# EAGLE design playameter (EAGLE 5.10)
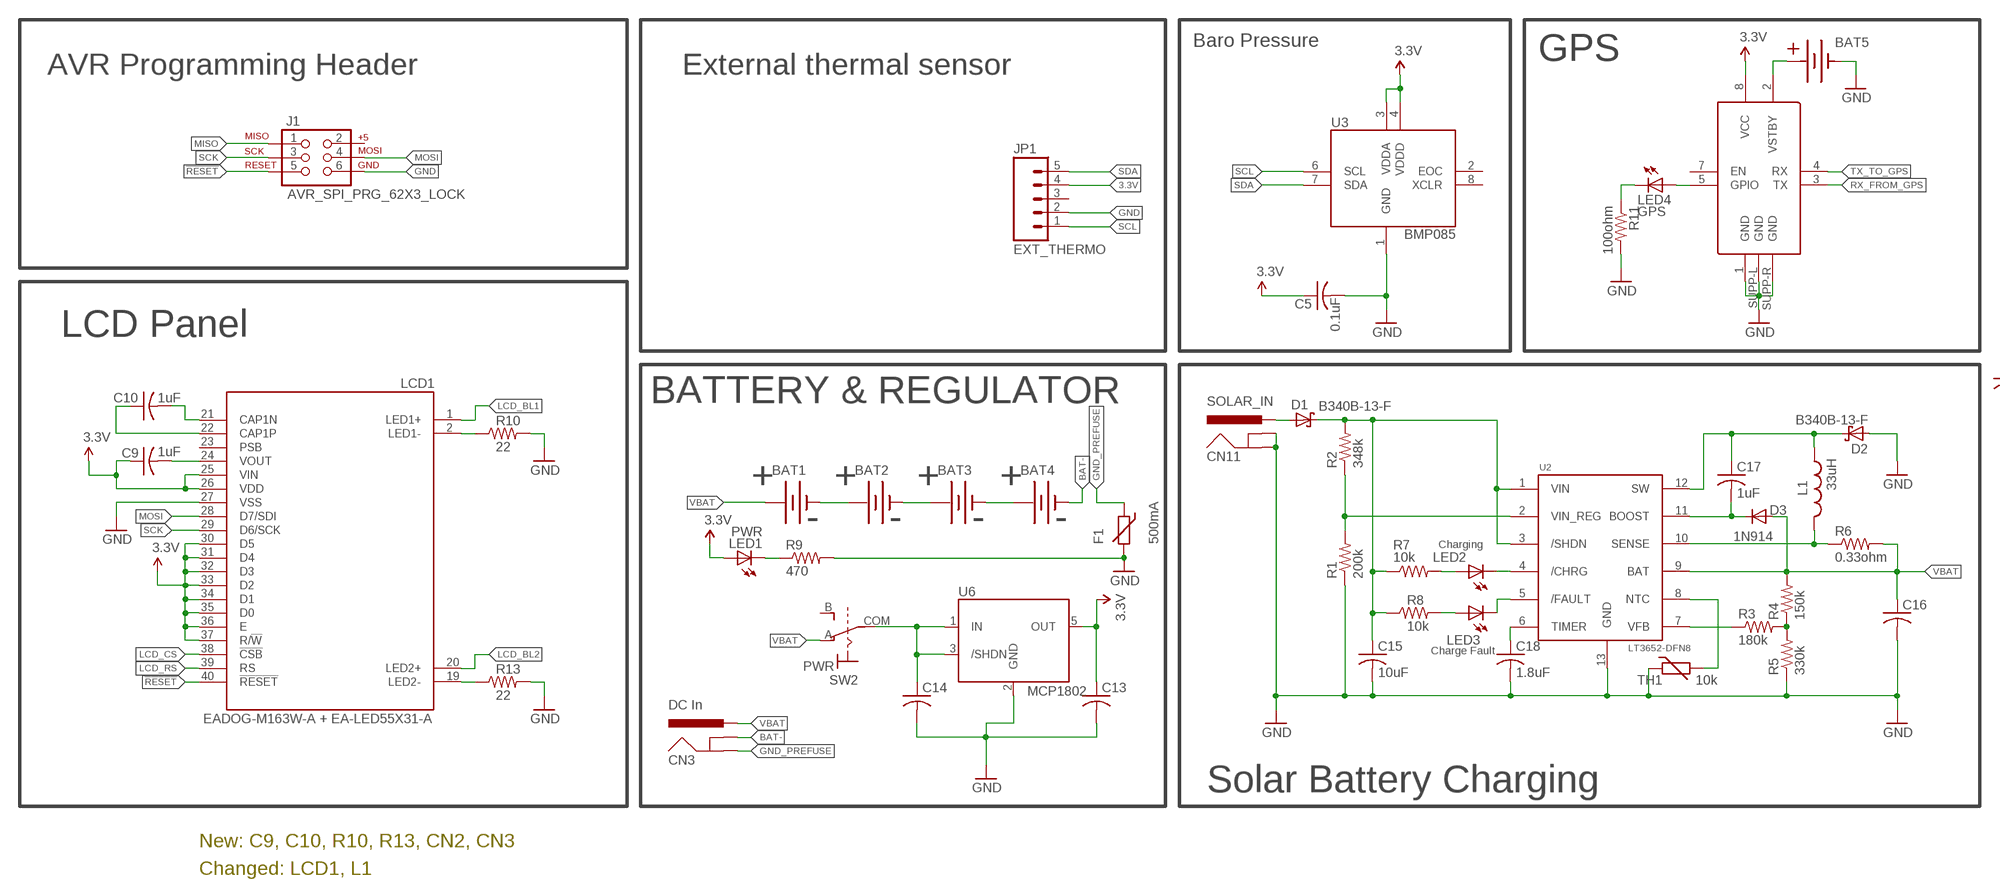
[diagram p0: schematic, sheet 1, part 1 of 2]
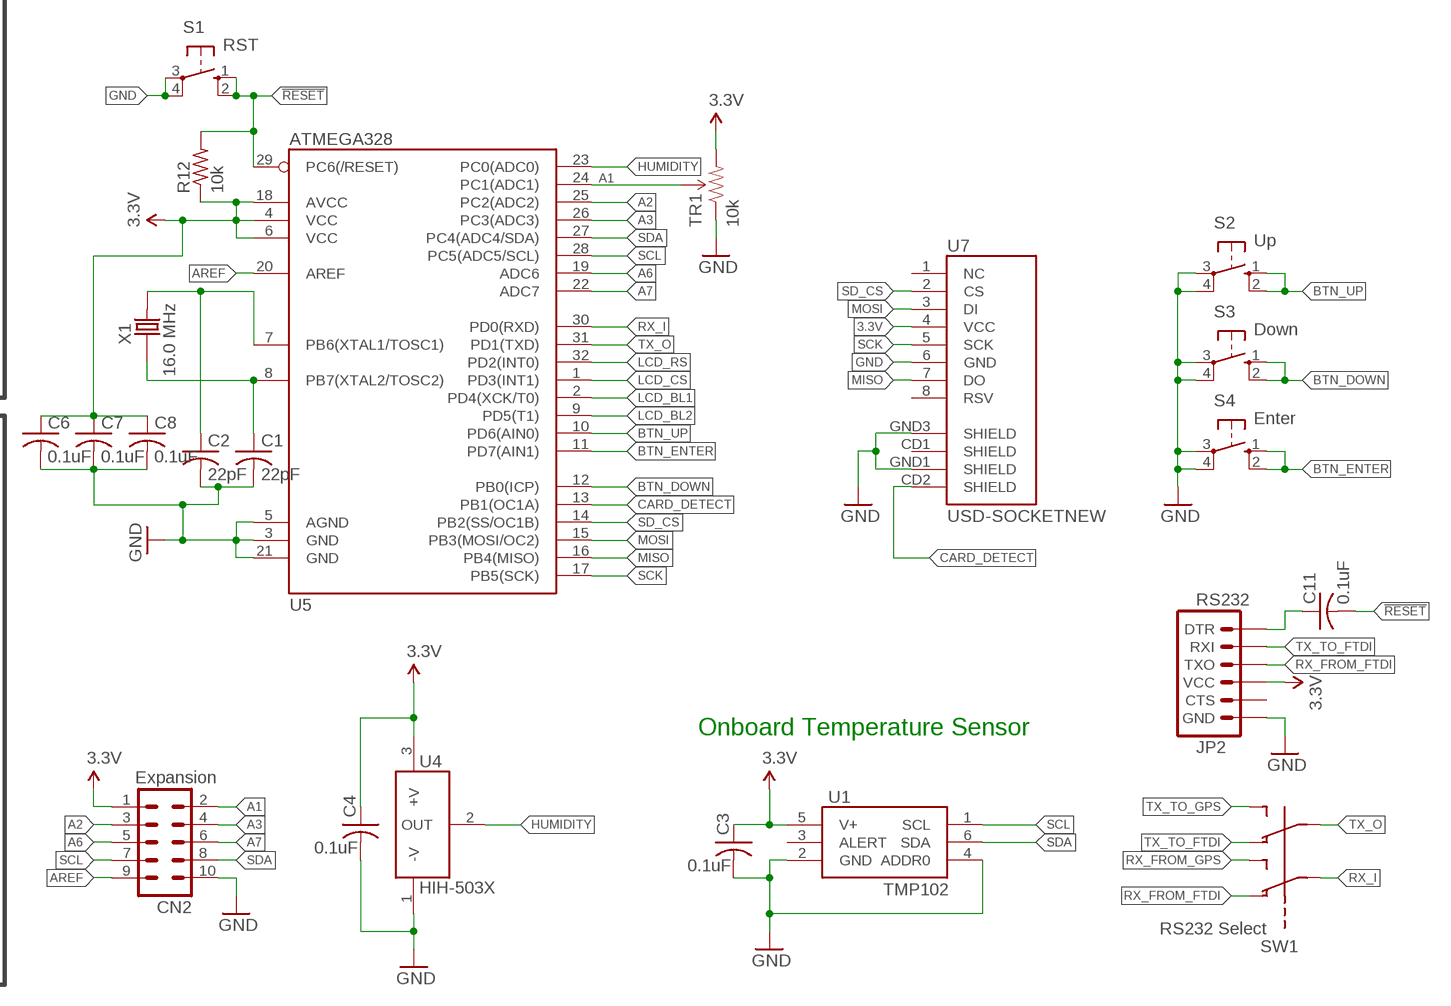
[diagram p1: schematic, sheet 1, part 2 of 2]

## Parts
BAT1  BATTERYAA  [BATTERY-AA]
BAT2  BATTERYAA  [BATTERY-AA]
BAT3  BATTERYAA  [BATTERY-AA]
BAT4  BATTERYAA  [BATTERY-AA]
BAT5  CR2032  [BK-912-CR2032]
C1  22pF  C-USC0603  [C0603]
C2  22pF  C-USC0603  [C0603]
C3  0.1uF  C-USC0603  [C0603]
C4  0.1uF  C-USC0603  [C0603]
C5  0.1uF  C-USC0603  [C0603]
C6  0.1uF  C-USC0603  [C0603]
C7  0.1uF  C-USC0603  [C0603]
C8  0.1uF  C-USC0603  [C0603]
C9  1uF  C-USC0805  [C0805]
C10  1uF  C-USC0805  [C0805]
C11  0.1uF  C-USC0603  [C0603]
C13  C-USC0603  [C0603]
C14  C-USC0603  [C0603]
C15  10uF  C-USC0805  [C0805]
C16  C-USC0805  [C0805]
C17  1uF  C-USC0805  [C0805]
C18  1.8uF  C-USC0805  [C0805]
CN2  Expansion  MA05-2  [MA05-2]
CN3  DC In  POWER_JACKPTH_LOCK  [POWER_JACK_PTH_LOCK]
CN11  SOLAR_IN  POWER_JACKPTH_LOCK  [POWER_JACK_PTH_LOCK]
D1  B340B-13-F  SCHOTTKY-DIODESMD  [SMB]
D2  B340B-13-F  SCHOTTKY-DIODESMD  [SMB]
D3  1N914  DIODE-SOD323-R  [SOD323-R]
F1  500mA  SMDTHERMISTOR1206  [1206]
J1  AVR_SPI_PRG_62X3_LOCK  [2X3_LOCK]
JP1  EXT_THERMO  M05LOCK  [1X05_LOCK]
JP2  RS232  ARDUINO_SERIAL_PROGRAMLOCK  [1X06_LOCK]
L1  33uH  TAIYOYUDEN-NR6045  [TAIYOYUDEN-NR6045]
LCD1  EADOG-M163W-A + EA-LED55X31-A  EADOG-M  [EADOG-M]
LED1  PWR  LEDCHIP-LED0603  [CHIP-LED0603]
LED2  Charging  LEDCHIP-LED0603  [CHIP-LED0603]
LED3  Charge Fault  LEDCHIP-LED0603  [CHIP-LED0603]
LED4  GPS  LEDCHIP-LED0603  [CHIP-LED0603]
R1  200k  R-US_R0603  [R0603]
R2  348k  R-US_R0603  [R0603]
R3  180k  R-US_R0603  [R0603]
R4  150k  R-US_R0603  [R0603]
R5  330k  R-US_R0603  [R0603]
R6  0.33ohm  R-US_R2512  [R2512]
R7  10k  R-US_R0603  [R0603]
R8  10k  R-US_R0603  [R0603]
R9  470  R-US_R0603  [R0603]
R10  22  R-US_R0603  [R0603]
R11  100ohm  R-US_R0603  [R0603]
R12  10k  R-US_R0603  [R0603]
R13  22  R-US_R0603  [R0603]
S1  RST  10-XX  [B3F-10XX]
S2  Up  10-XX  [B3F-10XX]
S3  Down  10-XX  [B3F-10XX]
S4  Enter  10-XX  [B3F-10XX]
SW1  RS232 Select  JS202011AQN  [JS202011AQN]
SW2  PWR  CARLING-M6-SPDT  [CARLING-M6]
TH1  10k  SMDTHERMISTOR0805  [0805]
TR1  10k  TRIMPOTSMD  [TRIMPOT-3MM]
U1  TMP102  [SOT563]
U2  LT3652-DFN8  [DFN8-LT3652]
U3  BMP085  [8-CLCC]
U4  HIH-503X  [HIH-503X]
U5  ATMEGA328  ATMEGA168  [TQFP32-08]
U6  MCP1802  [SOT23-5]
U7  USD-SOCKETNEW  [MICRO-SD-SOCKET-PP]
U8  LS200X6  [LS200X6]
X1  16.0 MHz  NX5032GA  [NX5032GA]

## Nets
3.3V: C3.1 C4.1 C5.1 C6.1 C7.1 C8.1 C9.1 C13.1 CN2.1 JP1.4 JP2.4(VCC) LCD1.25(VIN) LCD1.26(VDD) LCD1.30(D5) LCD1.31(D4) LCD1.32(D3) LCD1.33(D2) LCD1.34(D1) LCD1.35(D0) LCD1.36(E) LCD1.37(R/!W!) LED1.A R12.1 TR1.3(CW) U1.5(V+) U3.3(VDDA) U3.4(VDDD) U4.3(+V) U5.4(VCC) U5.6(VCC) U5.18(AVCC) U6.5(OUT) U7.4(VCC) U8.8(VCC)
!CHRG_LED: LED2.C U2.4(/CHRG)
!CHRGFLT_LED: LED3.C U2.5(/FAULT)
!RESET: C11.2 J1.5 LCD1.40(!RESET!) R12.2 S1.1(S) S1.2(S1) U5.29(PC6(/RESET))
A1: CN2.2 TR1.2(WIPER) U5.24(PC1(ADC1))
A2: CN2.3 U5.25(PC2(ADC2))
A3: CN2.4 U5.26(PC3(ADC3))
A6: CN2.5 U5.19(ADC6)
A7: CN2.6 U5.22(ADC7)
AREF: CN2.9 U5.20(AREF)
BAT1_2: BAT1.GND@1(-) BAT2.PWR@1(+)
BAT2_3: BAT2.GND@1(-) BAT3.PWR@1(+)
BAT3_4: BAT3.GND@1(-) BAT4.PWR@1(+)
BAT-: BAT4.GND@1(-) CN3.GNDBREAK
BL1_R: LCD1.2(LED1-) R10.1
BL2_R: LCD1.19(LED2-) R13.1
BTN_DOWN: S3.1(S) S3.2(S1) U5.12(PB0(ICP))
BTN_ENTER: S4.1(S) S4.2(S1) U5.11(PD7(AIN1))
BTN_UP: S2.1(S) S2.2(S1) U5.10(PD6(AIN0))
CARD_DETECT: U5.13(PB1(OC1A)) U7.CD2(SHIELD)
CHRG_BOOST: C17.2 D3.C U2.11(BOOST)
CHRG_NTC: TH1.2 U2.8(NTC)
CHRG_OUTFB: R3.1 U2.7(VFB)
CHRG_OUTFBDIV: R3.2 R4.1 R5.2
CHRG_SENSE: L1.1 R6.1 U2.10(SENSE)
CHRG_SW: C17.1 D2.C L1.2 U2.12(SW)
CHRG_TIMER: C18.1 U2.6(TIMER)
FTDI_!RESET: C11.1 JP2.1(DTR)
GND: BAT5.-(-1) C1.2 C2.2 C3.2 C4.2 C5.2 C6.2 C7.2 C8.2 C13.2 C14.2 C15.2 C16.2 C18.2 CN2.10 CN11.GND CN11.GNDBREAK D2.A F1.2 J1.6 JP1.2 JP2.6(GND) LCD1.27(VSS) R1.1 R5.1 R9.2 R10.2 R11.2 R13.2 S1.3(P) S1.4(P1) S2.3(P) S2.4(P1) S3.3(P) S3.4(P1) S4.3(P) S4.4(P1) TH1.1 TR1.1(CCW) U1.2(GND) U1.4(ADDR0) U2.13(GND) U3.1(GND) U4.1(-V) U5.3(GND) U5.5(AGND) U5.21(GND) U6.2(GND) U7.6(GND) U7.GND1(SHIELD) U7.GND3(SHIELD) U8.1(GND) U8.SUPP-L(GND) U8.SUPP-R(GND)
GND_PREFUSE: CN3.GND F1.1
GPS_LED: LED4.A U8.5(GPIO)
HUMIDITY: U4.2(OUT) U5.23(PC0(ADC0))
LCD_BL1: LCD1.1(LED1+) U5.2(PD4(XCK/T0))
LCD_BL2: LCD1.20(LED2+) U5.9(PD5(T1))
LCD_CAP1N: C10.2 LCD1.21(CAP1N)
LCD_CAP1P: C10.1 LCD1.22(CAP1P)
LCD_CS: LCD1.38(!CSB!) U5.1(PD3(INT1))
LCD_RS: LCD1.39(RS) U5.32(PD2(INT0))
LCD_VOUT: C9.2 LCD1.24(VOUT)
LED1_R: LED1.C R9.1
LED2_R: LED2.A R7.2
LED3_R: LED3.A R8.2
LED4_R: LED4.C R11.1
MISO: J1.1 U5.16(PB4(MISO)) U7.7(DO)
MOSI: J1.4 LCD1.28(D7/SDI) U5.15(PB3(MOSI/OC2)) U7.3(DI)
RX_FROM_FTDI: JP2.3(TXO) SW1.1A
RX_FROM_GPS: SW1.1B U8.3(TX)
RX_I: SW1.1 U5.30(PD0(RXD))
SCK: J1.3 LCD1.29(D6/SCK) U5.17(PB5(SCK)) U7.5(SCK)
SCL: CN2.7 JP1.1 U1.1(SCL) U3.6(SCL) U5.28(PC5(ADC5/SCL))
SD_CS: U5.14(PB2(SS/OC1B)) U7.2(CS)
SDA: CN2.8 JP1.5 U1.6(SDA) U3.7(SDA) U5.27(PC4(ADC4/SDA))
SOLAR: CN11.PWR D1.A
SOLAR_POSTD1: C15.1 D1.C R2.2 R7.1 R8.1 U2.1(VIN) U2.3(/SHDN)
TX_O: SW1.2 U5.31(PD1(TXD))
TX_TO_FTDI: JP2.2(RXI) SW1.2A
TX_TO_GPS: SW1.2B U8.4(RX)
VBAT: BAT1.PWR@1(+) C16.1 CN3.PWR D3.A R4.2 R6.2 SW2.A U2.9(BAT)
VBAT_SW: C14.1 SW2.COM U6.1(IN) U6.3(/SHDN)
VIN_FB: R1.2 R2.1 U2.2(VIN_REG)
VSTBY: BAT5.+1(+2) U8.2(VSTBY)
XTAL1: C2.1 U5.7(PB6(XTAL1/TOSC1)) X1.P$2
XTAL2: C1.1 U5.8(PB7(XTAL2/TOSC2)) X1.P$1
Unconnected: J1.2 JP1.3 JP2.5(CTS) LCD1.23(PSB) SW2.B U1.3(ALERT) U3.2(EOC) U3.8(XCLR) U7.1(NC) U7.8(RSV) U7.CD1(SHIELD) U8.7(EN)

## Notes on the sheet
- Baro Pressure
- GPS
- AVR Programming Header | External thermal sensor
- LCD Panel
- BATTERY & REGULATOR
- + | + | + | +
- - | - | - | -
- Onboard Temperature Sensor
- Solar Battery Charging
- New: C9, C10, R10, R13, CN2, CN3
- Changed: LCD1, L1

## Library data of the parts
BAT1-BAT4 = SparkFun:BATTERY: Battery Holders Various common sizes : AA, AAA, 20mm coin cell and 12mm coin cell.
BAT5 = con-sen:CR2032
C1-C11 C13 C14 C16 C17 = rcl:C-US: CAPACITOR, American symbol
C15 C18 = resistor:C-US: CAPACITOR, American symbol
CN2 = con-lstb:MA05-2: PIN HEADER
CN3 CN11 = SparkFun:POWER_JACK: Power Jack This is the standard 5.5mm barrel jack for power. The PTH is the most common, proven, reliable, footprint. All others are experimental. The Slot footprint only works if the mill layer is transmitted to the PCB fab house so be warned. Spark Fun Electronics SKU : PRT-00119. Mating wall wart : TOL-00298 (and others)
D1 D2 = diode:SCHOTTKY-DIODE: Schottky Diode
D3 = diode:DIODE-: DIODE
F1 TH1 = thermistor-sen:SMDTHERMISTOR: Surface mount thermistors
J1 = SparkFun:AVR_SPI_PRG_6: AVR ISP 6 Pin This is the reduced ISP connector for AVR programming. Common on Arduino. This footprint will take up less PCB space and can be used with a 10-pin to 6-pin adapter such as SKU: BOB-08508
JP1 = SparkFun:M05: Header 5 Standard 5-pin 0.1" header. Use with straight break away headers (SKU : PRT-00116), right angle break away headers (PRT-00553), swiss pins (PRT-00743), machine pins (PRT-00117), and female headers (PRT-00115). Molex polarized connector foot print use with SKU : PRT-08230 with associated crimp pins and housings.
JP2 = SparkFun:ARDUINO_SERIAL_PROGRAM
L1 = inductor-sen:TAIYOYUDEN-NR6045
LCD1 = ea:EADOG-M
LED1-LED4 = led:LED: LED OSRAM: - CHIPLED LG R971, LG N971, LY N971, LG Q971, LY Q971, LO R971, LY R971 LH N974, LH R974 LS Q976, LO Q976, LY Q976 LO Q996 - Hyper CHIPLED LW Q18S LB Q993, LB Q99A, LB R99A - SideLED LS A670, LO A670, LY A670, LG A670, LP A670 LB A673, LV A673, LT A673, LW A673 LH A674 LY A675 LS A676, LA A676, LO A676, LY A676, LW A676 LS A679, LY A679, LG A679 - Hyper Micro SIDELED® LS Y876, LA Y876, LO Y876, LY Y876 LT Y87S - SmartLED LW L88C, LW L88S LB L89C, LB L89S, LG L890 LS L89K, LO L89K, LY L89K LS L896, LA L896, LO L896, LY L896 - TOPLED LS T670, LO T670, LY T670, LG T670, LP T670 LSG T670, LSP T670, LSY T670, LOP T670, LYG T670 LG T671, LOG T671, LSG T671 LB T673, LV T673, LT T673, LW T673 LH T674 LS T676, LA T676, LO T676, LY T676, LB T676, LH T676, LSB T676, LW T676 LB T67C, LV T67C, LT T67C, LS T67K, LO T67K, LY T67K, LW E67C LS E67B, LA E67B, LO E67B, LY E67B, LB E67C, LV E67C, LT E67C LW T67C LS T679, LY T679, LG T679 LS T770, LO T770, LY T770, LG T770, LP T770 LB T773, LV T773, LT T773, LW T773 LH T774 LS E675, LA E675, LY E675, LS T675 LS T776, LA T776, LO T776, LY T776, LB T776 LHGB T686 LT T68C, LB T68C - Hyper Mini TOPLED® LB M676 - Mini TOPLED Santana® LG M470 LS M47K, LO M47K, LY M47K Source: http://www.osram.convergy.de LUXEON: - LUMILED® LXK2-PW12-R00, LXK2-PW12-S00, LXK2-PW14-U00, LXK2-PW14-V00 LXK2-PM12-R00, LXK2-PM12-S00, LXK2-PM14-U00 LXK2-PE12-Q00, LXK2-PE12-R00, LXK2-PE12-S00, LXK2-PE14-T00, LXK2-PE14-U00 LXK2-PB12-K00, LXK2-PB12-L00, LXK2-PB12-M00, LXK2-PB14-N00, LXK2-PB14-P00, LXK2-PB14-Q00 LXK2-PR12-L00, LXK2-PR12-M00, LXK2-PR14-Q00, LXK2-PR14-R00 LXK2-PD12-Q00, LXK2-PD12-R00, LXK2-PD12-S00 LXK2-PH12-R00, LXK2-PH12-S00 LXK2-PL12-P00, LXK2-PL12-Q00, LXK2-PL12-R00 Source: www.luxeon.com KINGBRIGHT: KA-3528ASYC Source: www.kingbright.com
R1-R13 = rcl:R-US_: RESISTOR, American symbol
S1-S4 = switch-omron:10-XX: OMRON SWITCH
SW1 = switch-sen:JS202011AQN: Micro DPDT slide switch
SW2 = switch-sen:CARLING-M6-SPDT: Carling M6-termination toggle switches.
TR1 = SparkFun:TRIMPOT
U1 = texas-sen:TMP102: Texas Instruments TMP102 temperature sensor
U2 = linear-sen:LT3652-DFN8
U3 = bosch-sen:BMP085: Bosch BMP085 barometric pressure sensor
U4 = honeywell-sen:HIH-503X: Honeywell HIH-5030/5031 humidity sensor
U5 = SparkFun:ATMEGA168
U6 = microchip-vreg:MCP1802: Microchip MCP1802 300mA low-dropout voltage regulator.
U7 = SparkFun:USD-SOCKET: microSD Socket Push-push type uSD socket. Schematic element and footprint production proven. Spark Fun Electronics SKU : PRT-00127. tDoc lines correctly indicate media card edge positions when inserting (unlocked, locked, depressed).
U8 = locosys-sen:LS200X6: Locosys LS200X6 GPS module w/ integrated antenna
X1 = crystal-sen:NX5032GA

## Board
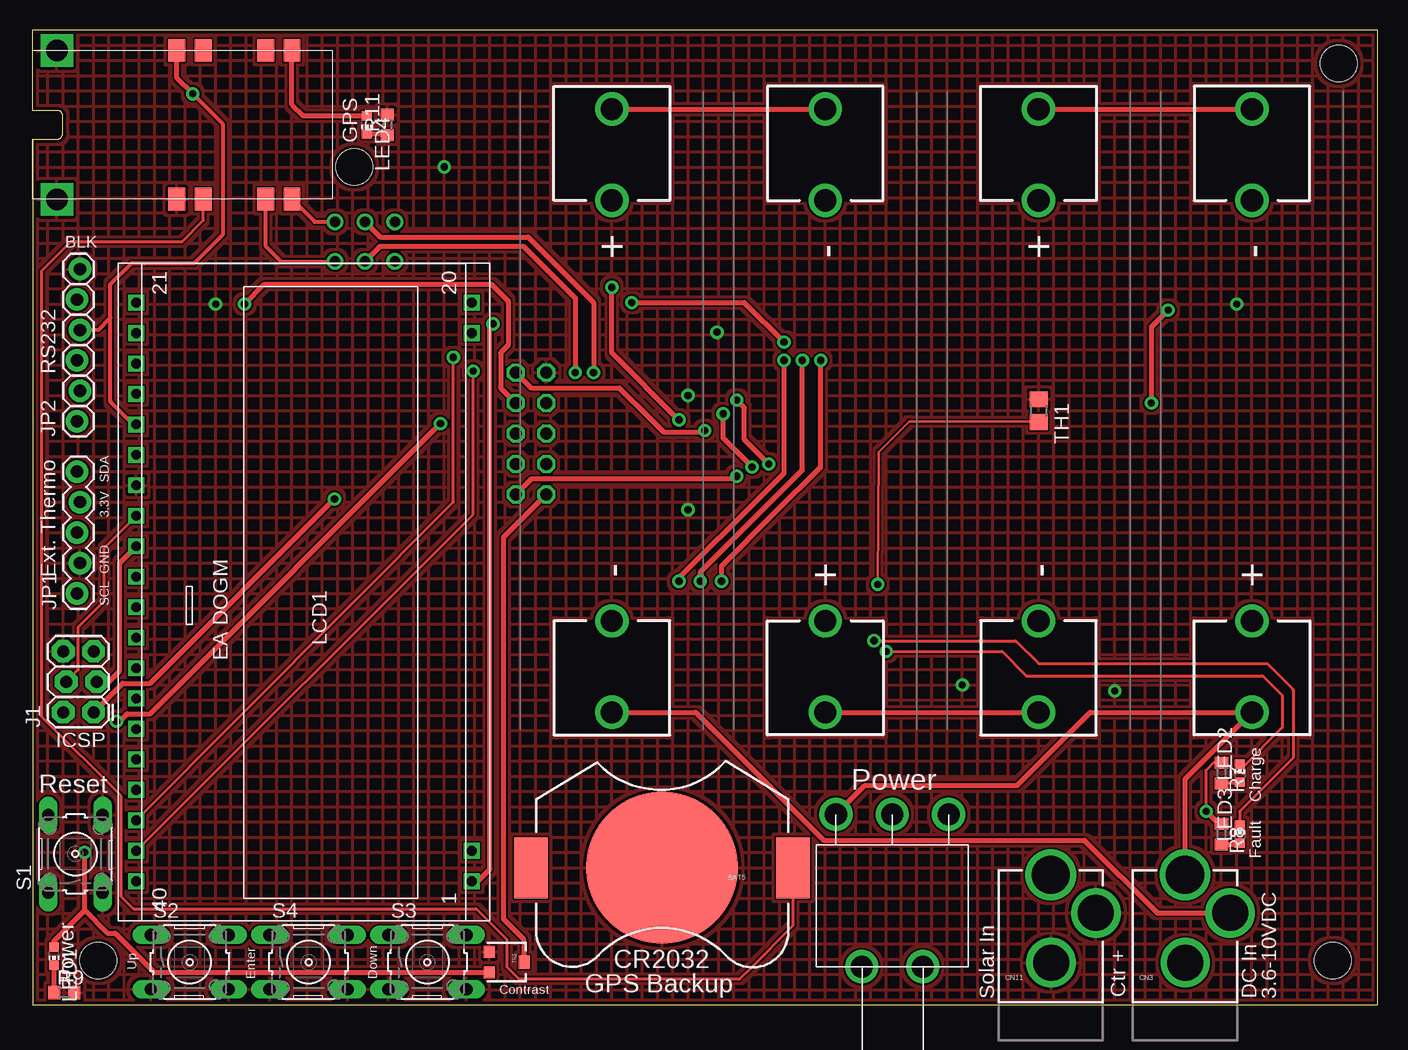
[diagram p2: board, top side]
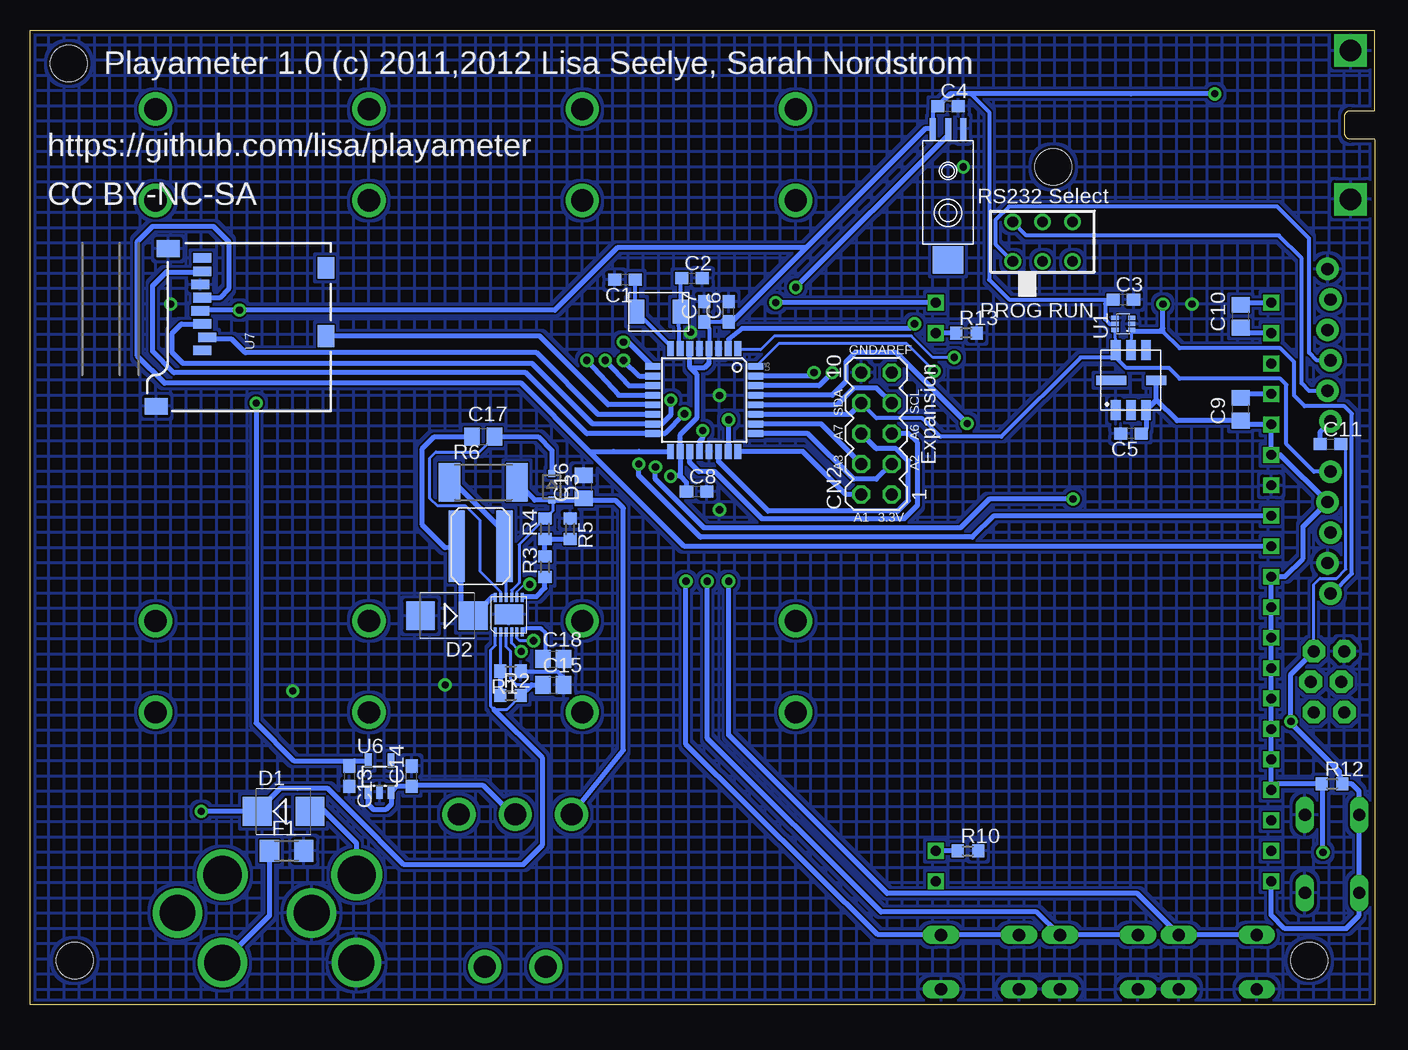
[diagram p3: board, bottom side, seen from below]

Size 112.06 x 81.27 mm. Coordinates in mm from the lower left corner, seen from the top.
Outline: 0,81.27 112.06,81.27 112.06,0 0,0 0,72.14
Outline: 0,74.55 0,81.27
Copper layers (1*16): Top 0.035mm / dielectric 1.5mm / Bottom 0.035mm
Design rules "LaenPCB *": minimum track width 6mil, minimum drill 20mil, track to track 6mil, track to pad 6mil, pad to pad 6mil, via to via 6mil, smd to smd 6mil, copper to edge 10mil, drill to drill 6mil, minimum pad ring 10mil, minimum via ring 10mil, stop-mask expansion 4mil, vias tented up to drill 25mil, thermal gap 10mil
Holes 3.05 mm at 108.33,3.68 108.84,78.49 26.8,69.85 5.46,3.68

### Footprints (pad centres in the part's own frame; a part is rotated, then mirrored left to right if it is on the bottom)
BATTERY-AA = drill 1.854 round: GND@1 25.146,0; GND@2 17.526,0; PWR@1 -25.146,0; PWR@2 -17.526,0
BK-912-CR2032 = smd 2.794 x 5.08: +1 -10.922,0; +2 10.922,0 | smd 12.7 x 12.7: - 0,0
C0603 = smd 1.1 x 1: 1 -0.85,0; 2 0.85,0
C0805 = smd 1.3 x 1.5: 1 -0.95,0; 2 0.95,0
C0805' = smd 1.3 x 1.5: 1 -0.85,0; 2 0.85,0
MA05-2 = drill 1.016 octagon: 1 -5.08,-1.27; 2 -5.08,1.27; 3 -2.54,-1.27; 4 -2.54,1.27; 5 0,-1.27; 6 0,1.27; 7 2.54,-1.27; 8 2.54,1.27; 9 5.08,-1.27; 10 5.08,1.27
POWER_JACK_PTH_LOCK = drill 2.997 pad 4.115 round: GND 0.025,6.557; GNDBREAK 3.762,10.7 | drill 3.2 pad 4.115 round: PWR 0,13.878
SMB = smd 2.4 x 2.4: A 2.2,0; C -2.2,0
SOD323-R = smd 0.6 x 0.6: A 1.1,0; C -1.1,0
1206 = smd 1.6 x 1.803: 1 -1.422,0; 2 1.422,0
2X3_LOCK = drill 1.016 pad 1.88 octagon: 1 0,0; 2 0,2.54; 3 2.54,-0.254; 4 2.54,2.286; 5 5.08,0; 6 5.08,2.54
1X05_LOCK = drill 1.016 pad 1.88 round: 1 0,0.127; 2 2.54,-0.127; 3 5.08,0.127; 4 7.62,-0.127; 5 10.16,0.127
1X06_LOCK = drill 1.016 pad 1.88 round: 1 0,0; 2 2.54,-0.254; 3 5.08,0; 4 7.62,-0.254; 5 10.16,0; 6 12.7,-0.254
TAIYOYUDEN-NR6045 = smd 5.994 x 1.346: 1 0,-1.905; 2 0,2.083
EADOG-M = drill 0.813 square: 1 0,0; 2 2.54,0; 19 45.72,0; 20 48.26,0; 21 48.26,27.94; 22 45.72,27.94; 23 43.18,27.94; 24 40.64,27.94; 25 38.1,27.94; 26 35.56,27.94; 27 33.02,27.94; 28 30.48,27.94; 29 27.94,27.94; 30 25.4,27.94; 31 22.86,27.94; 32 20.32,27.94; 33 17.78,27.94; 34 15.24,27.94; 35 12.7,27.94; 36 10.16,27.94; 37 7.62,27.94; 38 5.08,27.94; 39 2.54,27.94; 40 0,27.94
CHIP-LED0603 = smd 0.8 x 0.8: A 0,-0.75; C 0,0.75
R0603 = smd 1 x 1.1: 1 -0.85,0; 2 0.85,0
R2512 = smd 1.8 x 3.2: 1 -2.8,0; 2 2.8,0
B3F-10XX = drill 1.016 long: 1 -3.251,2.261; 2 3.251,2.261; 3 -3.251,-2.261; 4 3.251,-2.261
JS202011AQN = drill 0.889 round: 1 0,0; 1A -2.489,0; 1B 2.489,0; 2 0,3.302; 2A -2.489,3.302; 2B 2.489,3.302
CARLING-M6 = drill 1.854 round: A 12.7,4.699; B 12.7,-4.699; COM 12.7,0; SUPPORT1 0,2.54; SUPPORT2 0,-2.54
0805 = smd 1.3 x 1.5: 1 -0.95,0; 2 0.95,0
TRIMPOT-3MM = smd 1 x 0.9: 1 -0.85,-1.45; 3 0.85,-1.45 | smd 1.1 x 0.9: 2 0,1.45
SOT563 = smd 0.343 x 0.6: 1 -0.5,-0.7; 2 0,-0.7; 3 0.5,-0.7; 4 0.5,0.7; 5 0,0.7; 6 -0.5,0.7
DFN8-LT3652 = smd 0.25 x 0.762: 1 -0.9,-1.297; 2 -0.45,-1.297; 3 0,-1.297; 4 0.45,-1.297; 5 0.9,-1.297; 6 1.35,-1.297; 7 1.35,1.567; 8 0.9,1.567; 9 0.45,1.567; 10 0,1.567; 11 -0.45,1.567; 12 -0.9,1.567 | smd 2.38 x 1.65: 13 0.226,0.146
8-CLCC = smd 1.67 x 0.8: 1 -2.5,1.27; 2 -2.5,0; 3 -2.5,-1.27; 5 2.5,-1.27; 6 2.5,0; 7 2.5,1.27 | smd 0.8 x 1.67: 4 0,-2.125 | smd 0.8 x 2.5: 8 0,1.65
HIH-503X = smd 0.51 x 1.78: 1 -1.27,0; 2 0,0; 3 1.27,0 | smd 2.54 x 2.29: SUPPORT 0,10.925
TQFP32-08 = smd 1.27 x 0.559: 1 -4.293,2.8; 2 -4.293,2; 3 -4.293,1.2; 4 -4.293,0.4; 5 -4.293,-0.4; 6 -4.293,-1.2; 7 -4.293,-2; 8 -4.293,-2.8; 17 4.293,-2.8; 18 4.293,-2; 19 4.293,-1.2; 20 4.293,-0.4; 21 4.293,0.4; 22 4.293,1.2; 23 4.293,2; 24 4.293,2.8 | smd 0.559 x 1.27: 9 -2.8,-4.293; 10 -2,-4.293; 11 -1.2,-4.293; 12 -0.4,-4.293; 13 0.4,-4.293; 14 1.2,-4.293; 15 2,-4.293; 16 2.8,-4.293; 25 2.8,4.293; 26 2,4.293; 27 1.2,4.293; 28 0.4,4.293; 29 -0.4,4.293; 30 -1.2,4.293; 31 -2,4.293; 32 -2.8,4.293
SOT23-5 = smd 0.55 x 1.2: 1 -0.95,-1.3; 2 0,-1.3; 3 0.95,-1.3; 4 0.95,1.3; 5 -0.95,1.3
MICRO-SD-SOCKET-PP = smd 0.8 x 1.5: 1 -8.94,10.7; 2 -7.84,10.3; 3 -6.74,10.7; 4 -5.64,10.9; 5 -4.54,10.7; 6 -3.44,10.9; 7 -2.34,10.7; 8 -1.24,10.7 | smd 1.8 x 1.4: CD1 -2.05,0.4; CD2 -7.75,0.4 | smd 1.4 x 1.9: GND1 -13.6,14.55; GND3 -0.45,13.55
LS200X6 = smd 1.9 x 1.4: 1 -6.5,0.5; 2 -6.5,-1.7; 3 -6.5,-6.9; 4 -6.5,-9.1; 5 5.9,-9.1; 6 5.9,-6.9; 7 5.9,-1.7; 8 5.9,0.5 | drill 1.8 square: SUPP-L -6.5,10.5; SUPP-R 5.9,10.5
NX5032GA = smd 1.3 x 2: P$1 -1.85,0; P$2 1.85,0

### Placement (x,y rotation side)
BAT1  101.6,49.53 90 top
BAT2  83.82,49.53 270 top
BAT3  66.04,49.53 90 top
BAT4  48.26,49.53 270 top
BAT5  52.45,11.43 180 top
C1  62.48,60.45 180 bottom
C2  56.9,60.58 0 bottom
C3  20.95,58.8 0 bottom
C4  35.56,74.93 0 bottom
C5  20.32,47.62 180 bottom
C6  53.85,57.78 90 bottom
C7  55.88,57.78 90 bottom
C8  56.52,42.8 0 bottom
C9  11.18,49.66 90 bottom
C10  11.18,57.4 90 bottom
C11  3.68,46.74 0 bottom
C13  85.47,19.05 270 bottom
C14  80.26,19.05 90 bottom
C15  10uF  [C0805']  68.45,26.67 0 bottom
C16  65.91,43.18 90 bottom
C17  74.3,47.37 0 bottom
C18  1.8uF  [C0805']  68.45,28.83 0 bottom
CN2  41.53,47.62 90 bottom
CN3  96.01,-3.05 0 top
CN11  84.84,-3.05 0 top
D1  90.93,16.13 0 bottom
D2  77.32,32.43 180 bottom
D3  68.58,43.18 270 bottom
F1  90.68,12.83 0 bottom
J1  5.08,24.38 90 top
JP1  3.81,34.29 90 top
JP2  3.68,48.64 90 top
L1  74.42,38.23 90 bottom
LCD1  36.58,10.29 90 top
LED1  1.78,4.06 180 top
LED2  100.58,19.3 0 top
LED3  100.58,14.22 0 top
LED4  27.84,73.36 180 top
R1  72.01,27.81 180 bottom
R2  72.01,25.78 0 bottom
R3  69.15,36.51 90 bottom
R4  69.15,39.67 90 bottom
R5  67.06,39.67 270 bottom
R6  74.3,43.56 0 bottom
R7  99.06,19.3 270 top
R8  99.06,14.22 270 top
R9  2.63,1.02 0 top
R10  33.91,12.83 0 bottom
R11  29.55,73.36 90 top
R12  3.56,18.41 0 bottom
R13  34.04,56.01 0 bottom
S1  3.56,12.57 90 top
S2  13.08,3.56 0 top
S3  32.89,3.56 0 top
S4  22.99,3.56 0 top
SW1  27.69,61.98 0 bottom
SW2  71.63,3.17 90 top
TH1  83.82,49.53 270 top
TR1  39.5,3.56 270 top
U1  20.95,56.77 90 bottom
U2  72.39,32.38 0 bottom
U3  20.32,52.07 90 bottom
U4  35.56,73.03 180 bottom
U5  55.88,50.42 270 bottom
U6  82.93,19.05 0 bottom
U7  87,63.5 90 bottom
U8  12.51,73.66 90 top
X1  59.69,57.78 0 bottom

### Tracks (layer width: path | path; a pad name or v marks a point on that pad's centre or on a via)
3.3V  (via drill 0.6)
  Top 0.33: LCD1.25 8.38,48.39 6.48,50.29 6.48,57.28 | 6.48,57.28 6.48,60.07 8.26,61.85 13.46,61.85 15.88,64.26 15.88,73.41 13.46,75.82 v13.34,75.95 | JP2.4 5.46,56.26 6.48,57.28
  Top 0.406: 4.32,7.87 v4.32,12.7 | U8.8 12.01,77.27 v13.34,75.95 | TR1.3 10.11,2.71 9.09,3.73 6.86,5.97 6.22,5.97 4.32,7.87 | 93.22,56.52 v93.22,50.16 93.22,56.52 | 93.22,56.52 v94.61,57.91 93.22,56.52 | CN2.1 41.4,43.69 41.53,43.81 58.42,43.81 v58.67,44.07 | LED1.A 1.78,5.33 4.32,7.87
  Bottom 0.254: U3.4 18.2,50.51 18.29,50.42
  Bottom 0.33: U4.3 36.83,74.51 C4.1 | C6.1 C7.1 55.48,56.41 U5.4 55.5,54.69 | U1.5 22.1,56.77 22.48,57.15 22.48,58.42 22.1,58.8 C3.1 30.48,58.8 32.13,60.45 32.13,74.42 33.66,75.95
  Bottom 0.406: 85.02,20.35 U6.5 | 85.02,20.35 C13.1 | v4.32,12.7 4.32,18.03 4.38,18.1 4.38,18.41 R12.1 8.13,18.41 LCD1.37 LCD1.36 LCD1.35 LCD1.34 LCD1.33 LCD1.32 LCD1.31 LCD1.30 7.49,35.69 5.97,37.21 5.97,39.88 JP1.4 7.87,45.85 LCD1.26 LCD1.25 10.47,48.39 C9.1 16.48,48.71 18.2,50.42 | 18.2,50.42 U3.4 | 18.2,50.42 U3.3 19.05,48.05 C5.1 | v13.34,75.95 20.32,75.95 33.66,75.95 35.39,75.95 C4.1 | U4.3 37.47,73.03 47.12,63.37 | 53.89,57.02 C6.1 54.06,57.02 54.23,57.02 54.36,57.02 53.47,57.02 53.21,57.28 47.12,63.37 | 85.02,20.35 90.07,20.35 93.22,23.5 v93.22,50.16 | 97.97,57.78 U7.4 97.84,57.91 v94.61,57.91 68.33,57.91 63.12,63.12 47.37,63.12 47.12,63.37 | 57.91,44.07 57.87,44.07 57.37,43.56 C8.1 | 57.91,44.07 v58.67,44.07 | 57.08,53.16 U5.6 | 57.08,53.16 56.52,52.58 56.52,48.9 57.91,47.5 57.91,46.16 U5.18 57.88,44.33 57.88,44.1 57.91,44.07 | 55.5,54.69 55.5,53.47 55.88,53.09 57.01,53.09 57.08,53.16
!CHRG_LED  (via drill 0.6)
  Top 0.254: v71.12,29.46 80.77,29.46 82.8,27.43 102.49,27.43 104.14,25.78 104.14,23.11 100.7,19.67 LED2.C
  Bottom 0.254: U2.4 71.94,30.16 71.37,29.59 v71.12,29.46
!CHRGFLT_LED  (via drill 0.6)
  Top 0.254: v70.1,30.35 81.92,30.35 83.82,28.45 91.06,28.45 91.69,28.45 102.87,28.45 105.03,26.29 105.03,20.57 100.58,16.13 LED3.C
  Bottom 0.254: U2.5 71.49,30.6 71.25,30.35 v70.1,30.35
!RESET  (via drill 0.6)
  Top 0.406: v6.99,23.62 7.24,23.62 7.87,24.26 9.78,24.26 v33.97,48.45
  Bottom 0.254: 2.54,46.48 2.41,46.48 2.41,36.32 3.17,35.56 4.57,35.56 5.08,35.05 J1.5
  Bottom 0.406: R12.2 2.82,18.27 | R12.2 2.96,19.47 6.99,23.5 v6.99,23.62 6.99,27.56 5.46,29.08 | R12.2 1.91,18.41 1.29,17.8 S1.2 S1.1 1.29,7.47 2.41,6.35 7.49,6.35 8.64,7.49 LCD1.40 | 5.46,29.08 J1.5 5.46,29.08 | U5.29 45.19,50.82 44.07,51.94 44.07,53.59 43.31,54.36 39.88,54.36 v33.97,48.45 | C11.2 2.79,46.74 2.54,46.48
A1
  Top 0.406: TR1.2 40.95,5.41 39.24,7.11 39.24,38.99 CN2.2
  Bottom 0.406: U5.24 47.65,46.13 44.07,42.55 CN2.2
A2
  Bottom 0.406: U5.25 47.24,47.62 43.43,43.81 41.53,43.81 CN2.3
A3
  Bottom 0.406: U5.26 46.13,48.42 CN2.4
A6
  Bottom 0.406: U5.19 57.09,46.06 57.09,45.21 56.33,44.45 54.99,44.45 51.05,40.51 39.24,40.51 38.1,41.66 38.1,46.86 38.86,47.62 CN2.5
A7
  Bottom 0.406: CN2.6 41.53,46.35 39.88,46.35 38.86,45.34 38.86,42.04 39.75,41.15 50.55,41.15 54.36,44.96 54.68,45.28 U5.22
AREF  (via drill 0.6)
  Top 0.406: CN2.9 41.53,51.44 48.9,51.44 51.44,48.9 52.58,47.75 55.88,47.75 v56.01,47.88
  Bottom 0.406: v56.01,47.88 56.01,47.24 56.26,46.99 56.26,46.15 U5.20
BAT1_2
  Top 0.406: BAT2.PWR@1 BAT1.GND@1
BAT2_3
  Top 0.406: BAT3.PWR@1 BAT2.GND@1
BAT3_4
  Top 0.406: BAT4.PWR@1 BAT3.GND@1
BAT-
  Top 0.406: CN3.GNDBREAK 93.69,7.65 87.63,13.72 65.91,13.72 55.24,24.38 BAT4.GND@1
BL1_R
  Bottom 0.406: R10.1 LCD1.2
BL2_R
  Bottom 0.406: R13.1 LCD1.19
BTN_DOWN  (via drill 0.6)
  Top 0.406: v65.66,53.72 65.66,44.83 61.85,41.02 57.4,36.58 v57.4,35.31
  Bottom 0.406: S3.1 S3.2 36.17,5.84 41.4,5.84 57.4,21.72 v57.4,35.31 | U5.12 63.01,50.82 v65.66,53.72
BTN_ENTER  (via drill 0.6)
  Top 0.406: v64.14,53.72 64.14,44.58 61.34,41.78 55.63,36.07 v55.63,35.31
  Bottom 0.406: S4.1 S4.2 26.26,5.82 28.19,7.75 41.15,7.75 55.63,22.23 v55.63,35.31 | U5.11 62.16,51.62 v64.14,53.72
BTN_UP  (via drill 0.6)
  Top 0.406: v62.61,53.72 62.61,44.32 60.45,42.16 53.98,35.69 53.85,35.56 v53.85,35.31
  Bottom 0.406: S2.1 S2.2 19.79,9.27 40.64,9.27 53.85,22.48 v53.85,35.31 | U5.10 61.31,52.42 v62.61,53.72
CARD_DETECT
  Bottom 0.406: U7.CD2 69.59,55.75 63.88,50.04 60.19,50.04 U5.13
CHRG_BOOST
  Bottom 0.254: U2.11 72.84,34.42 73.15,34.73 74.55,36.13 74.55,40.39 75.75,41.59 78.11,41.59 78.74,42.23 78.74,45.59 78.23,46.1 74.61,46.1 C17.2
  Bottom 0.406: D3.C 68.58,46.23 69.72,47.37 C17.2
CHRG_NTC  (via drill 0.6)
  Top 0.203: v70.42,35.05 70.48,46.1 73.03,48.64 83.76,48.64 TH1.2
  Bottom 0.203: U2.8 71.49,34.43 70.87,35.05 v70.42,35.05
CHRG_OUTFB
  Bottom 0.254: U2.7 70.96,34.04
  Bottom 0.406: R3.1 69.15,34.74 69.85,34.04 70.96,34.04
CHRG_OUTFBDIV
  Bottom 0.406: R5.2 R4.1 R3.2
CHRG_SENSE
  Bottom 0.254: U2.10 72.39,36.83 72.52,36.96 L1.1
  Bottom 0.406: L1.1 72.52,39.36 76.58,43.43 76.58,43.56 R6.1
CHRG_SW
  Bottom 0.254: 73.41,34.08 U2.12
  Bottom 0.406: C17.1 75.11,47.37 78.36,47.37 79.38,46.35 79.38,40.01 78.36,38.99 77.47,38.1 L1.2 76.12,37.72 76.12,33.43 D2.C 73.47,34.08 73.41,34.04 73.41,34.08
CHRG_TIMER
  Bottom 0.203: C18.1 69.3,29.35
  Bottom 0.254: 71.02,31.09 U2.6 | 69.44,31.34 69.47,31.37
  Bottom 0.33: 71.02,31.09 70.74,31.37 69.47,31.37 | 69.44,31.34 69.09,30.99 69.09,29.39
  Bottom 0.406: 69.3,29.35 69.09,29.39
FTDI_!RESET
  Bottom 0.406: C11.1 4.53,47.79 JP2.1
GND  (via drill 0.6)
  Bottom 0.33: 71.06,27.75 68.36,27.75 68.07,27.75 67.63,27.3
  Bottom 0.406: R1.1 71.06,27.81 71.06,27.75 | C15.2 67.63,27.3
  other vias: 54.61,50.8 54.61,41.27 100.33,58.42 57.02,56.07 77.47,26.67 90.17,26.16 34.29,69.85 15.24,58.42
  pour Bottom (hatched): 0,81.28 112.14,81.28 112.14,0 0,0
  pour Top (hatched): 0,81.28 112.14,81.28 112.14,0 0,0
GND_PREFUSE
  Bottom 0.406: F1.1 92.1,7.45 CN3.GND
GPS_LED
  Top 0.254: 21.59,79.54 U8.5
  Top 0.406: U8.5 21.61,79.19 | LED4.A 22.54,74.11 21.59,75.06 21.59,79.54
HUMIDITY  (via drill 0.6)
  Top 0.406: v48.26,59.82 48.26,54.36 v53.85,48.77
  Bottom 0.406: U4.2 35.56,72.52 v48.26,59.82 | v53.85,48.77 53.85,46.16 U5.23
LCD_BL1  (via drill 0.6)
  Top 0.406: LCD1.1 37.08,10.29 38.1,11.3 38.1,56.52 v38.35,56.77
  Bottom 0.406: v38.35,56.77 38.73,56.39 52.71,56.39 53.85,55.5 53.85,54.71 U5.2
LCD_BL2  (via drill 0.6)
  Top 0.406: v49.91,58.55 59.31,58.55 v62.61,55.24
  Bottom 0.406: LCD1.20 v49.91,58.55 | v62.61,55.24 62.2,55.24 U5.9
LCD_CAP1N
  Bottom 0.406: LCD1.21 10.98,58.55 C10.2
LCD_CAP1P
  Bottom 0.406: LCD1.22 10.73,56.01 C10.1
LCD_CS  (via drill 0.6)
  Top 0.254: LCD1.38 35.05,41.91 35.05,52.2 v35.05,53.98
  Bottom 0.254: v35.05,53.98 36.83,53.98 38.61,55.75 50.04,55.75 51.18,54.61 52.98,54.61 U5.1
LCD_RS  (via drill 0.6)
  Top 0.254: LCD1.39 36.7,40.89 v36.7,52.83
  Bottom 0.254: v36.7,52.83 38.99,55.12 49.69,55.12 U5.32
LCD_VOUT
  Bottom 0.406: LCD1.24 11.12,50.93 C9.2
LED1_R
  Top 0.406: LED1.C R9.1
LED2_R
  Top 0.254: R7.2 100.48,18.45 LED2.A
LED3_R
  Top 0.406: R8.2 100.61,13.37 LED3.A
LED4_R
  Top 0.406: LED4.C 29.44,72.61 R11.1
MISO  (via drill 0.6)
  Top 0.406: J1.1 7.49,26.8 9.78,26.8 v25.15,42.16 | v57.53,49.28 57.53,47.24 v59.94,44.83
  Bottom 0.406: U7.7 97.77,61.09 100.71,61.09 101.85,59.94 101.85,54.48 100.08,52.7 70.74,52.7 65.65,47.62 U5.16 59.19,47.62 v57.53,49.28 | v25.15,42.16 32.13,42.16 34.54,39.75 55.88,39.75 57.28,41.15 59.94,43.81 v59.94,44.83
MOSI  (via drill 0.6)
  Top 0.254: J1.4 3.81,27.94 3.81,31.5 5.97,33.66 5.97,38.1 LCD1.28
  Top 0.406: v58.67,50.42 59.31,49.78 59.31,47.12 v61.34,45.09
  Bottom 0.406: U7.3 99.44,56.77 100.2,56.01 100.2,54.36 99.31,53.47 70.23,53.47 65.18,48.42 U5.15 59.4,48.42 58.67,49.15 v58.67,50.42 | LCD1.28 31.75,40.77 33.53,38.99 56.2,38.99 57.47,40.26 61.34,44.13 v61.34,45.09
RX_FROM_FTDI
  Bottom 0.33: JP2.3 4.83,53.72 5.46,54.36 5.46,63.88 8.13,66.55 30.48,66.55 31.62,65.41 31.62,63.42 SW1.1A
RX_FROM_GPS
  Top 0.33: SW1.1B 20.7,61.98 19.43,63.25 19.43,67.14 U8.3
RX_I  (via drill 0.6)
  Top 0.406: v45.21,52.7 45.21,58.93 40.89,63.25 28.96,63.25 SW1.1
  Bottom 0.406: U5.30 46.3,51.62 v45.21,52.7
SCK
  Top 0.406: J1.3 6.35,26.92 7.24,27.81 7.24,36.83 LCD1.29
  Bottom 0.406: 61.32,46.13 U5.17 61.32,46.13 | 61.32,46.13 63.44,46.13 65.43,46.13 65.53,46.23 | 65.53,46.23 71.12,51.82 100.84,51.82 103.12,54.1 103.12,63.63 101.85,64.9 96.77,64.9 95.5,63.63 95.5,59.69 96.27,58.93 97.66,58.93 U7.5 | LCD1.29 55.5,38.23 57.53,38.23 65.53,46.23
SCL  (via drill 0.6)
  Top 0.406: CN2.7 38.99,51.44 38.99,54.36 39.62,54.99 39.62,58.67 38.23,60.07 19.3,60.07 v17.65,58.42
  Bottom 0.254: 20.32,55.19 U1.1 20.12,56.13
  Bottom 0.33: 3.56,34.29 1.91,35.94 1.91,49.28 2.54,49.91 5.84,49.91 6.73,50.8 6.73,53.59 7.87,54.74 16.26,54.74 17.65,56.13
  Bottom 0.406: U5.28 44.85,50.02 43.43,51.44 41.53,51.44 CN2.7 | 20.32,55.19 U3.6 | JP1.1 3.56,34.29 | 17.65,56.13 17.91,56.13 | 17.91,56.13 20.12,56.13 | v17.65,58.42 17.65,56.39 17.91,56.13
SD_CS
  Bottom 0.406: U5.14 64.71,49.22 69.85,54.36 94.11,54.36 95.25,55.5 97.13,55.5 U7.2
SDA
  Bottom 0.254: 21.59,55.32 U1.6 | U3.7 21.63,54.61
  Bottom 0.33: JP1.5 5.08,44.45 7.37,46.74 7.37,51.69 7.87,52.2 16.26,52.2 17.14,53.09 20.7,53.09 21.59,53.98 | 21.59,53.98 U3.7 21.59,55.32 | 21.59,53.98 24.51,53.98 31.11,47.37 36.2,47.37 37.72,48.9 41.53,48.9 CN2.8
  Bottom 0.406: CN2.8 43.75,49.21 U5.27
SOLAR
  Bottom 0.406: CN11.PWR 84.84,13.46 88.39,17.02 88.65,17.02 88.52,17.14 88.52,16.17 D1.A
SOLAR_POSTD1  (via drill 0.6)
  Top 0.254: R7.1 99.15,20.19 98.42,20.19 97.79,19.56 v97.79,16.13 97.88,16.09
  Top 0.406: R8.1 98.59,15.33 v97.79,16.13
  Bottom 0.254: 70.27,26.67 71.5,26.67 72.01,27.18 72.01,29.46 72.39,29.84 U2.3 | U2.1 73.29,29.96 73.66,29.59 73.66,24.89 73.41,24.64 72.3,24.64 R2.2
  Bottom 0.406: C15.1 70.27,26.67 R2.2 | D1.C v97.79,16.13 D1.C | 73.41,24.64 69.34,20.57 69.34,13.34 70.99,11.68 80.9,11.68 84.96,15.75 87.25,18.03 89.79,18.03 91.23,18.03 D1.C
TX_O  (via drill 0.6)
  Top 0.406: v46.74,52.7 46.74,58.55 41.27,64.01 28.96,64.01 SW1.2
  Bottom 0.406: U5.31 47.02,52.42 v46.74,52.7
TX_TO_FTDI
  Bottom 0.33: JP2.2 5.46,51.18 6.1,51.82 6.1,62.23 8,64.14 29.03,64.14 SW1.2A
TX_TO_GPS
  Top 0.33: SW1.2B 23.49,65.28 U8.4
VBAT
  Top 0.406: SW2.A 69.34,18.29 82.04,18.29 88.14,24.38 BAT1.PWR@1 96.01,18.8 CN3.PWR
  Bottom 0.254: 68.52,42.02 68.52,41.16 R4.2 71.31,38.36 71.31,35.18 71.94,34.55 U2.9 | 68.54,42.04 D3.A
  Bottom 0.33: C16.1 66.23,42.23 66.42,42.04
  Bottom 0.406: 68.52,42.02 D3.A 70.01,42.08 R6.2 | SW2.A 62.61,21.21 62.61,41.4 63.25,42.04 66.42,42.04 68.54,42.04
VBAT_SW
  Bottom 0.406: SW2.COM 71.88,15.88 74.3,18.29 80.16,18.29 C14.1 81.53,18.2 U6.3 81.98,16.7 82.42,16.26 83.44,16.26 83.88,16.7 U6.1
VIN_FB
  Bottom 0.254: U2.2 72.84,28.47 R1.2
  Bottom 0.406: R1.2 R2.1
VSTBY
  Top 0.254: BAT5.+1 63.37,6.6 59.82,3.05 58.93,2.16 40.51,2.16 39.5,3.17 39.5,5.46 36.96,8 8.38,8 7.37,9.02 7.37,17.4 0.76,24 0.76,53.09 0.76,61.21 1.02,61.47 3.17,63.63 12.45,63.63 14.22,65.41 14.22,66.55 14.22,67.15 U8.2
XTAL1
  Bottom 0.33: U5.7 57.98,54.71 57.98,55.24 58.01,57.74 X1.P$2 57.84,60.48 C2.1
XTAL2
  Bottom 0.33: C1.1 61.63,57.88 X1.P$1 58.68,54.92 U5.8

### Text on the board
tPlace: GPS | BLK | RS232 | Ext. Thermo | SDA | 3.3V | GND | SCL | ICSP | Reset | Power | Charge | Fault | Up | CR2032 | Power | Enter | Down | Contrast | GPS Backup | Solar In | Ctr + | DC In | 3.6-10VDC
bPlace: Playameter 1.0 (c) 2011,2012 Lisa Seelye, Sarah Nordstrom | https://github.com/lisa/playameter | RS232 Select | CC BY-NC-SA | RUN | PROG | AREF | GND | Expansion | SCL | SDA | A6 | A7 | A2 | A3 | 3.3V | A1